# Altium schematic sheet Algorithm.SchDoc
size 420 x 297 mm
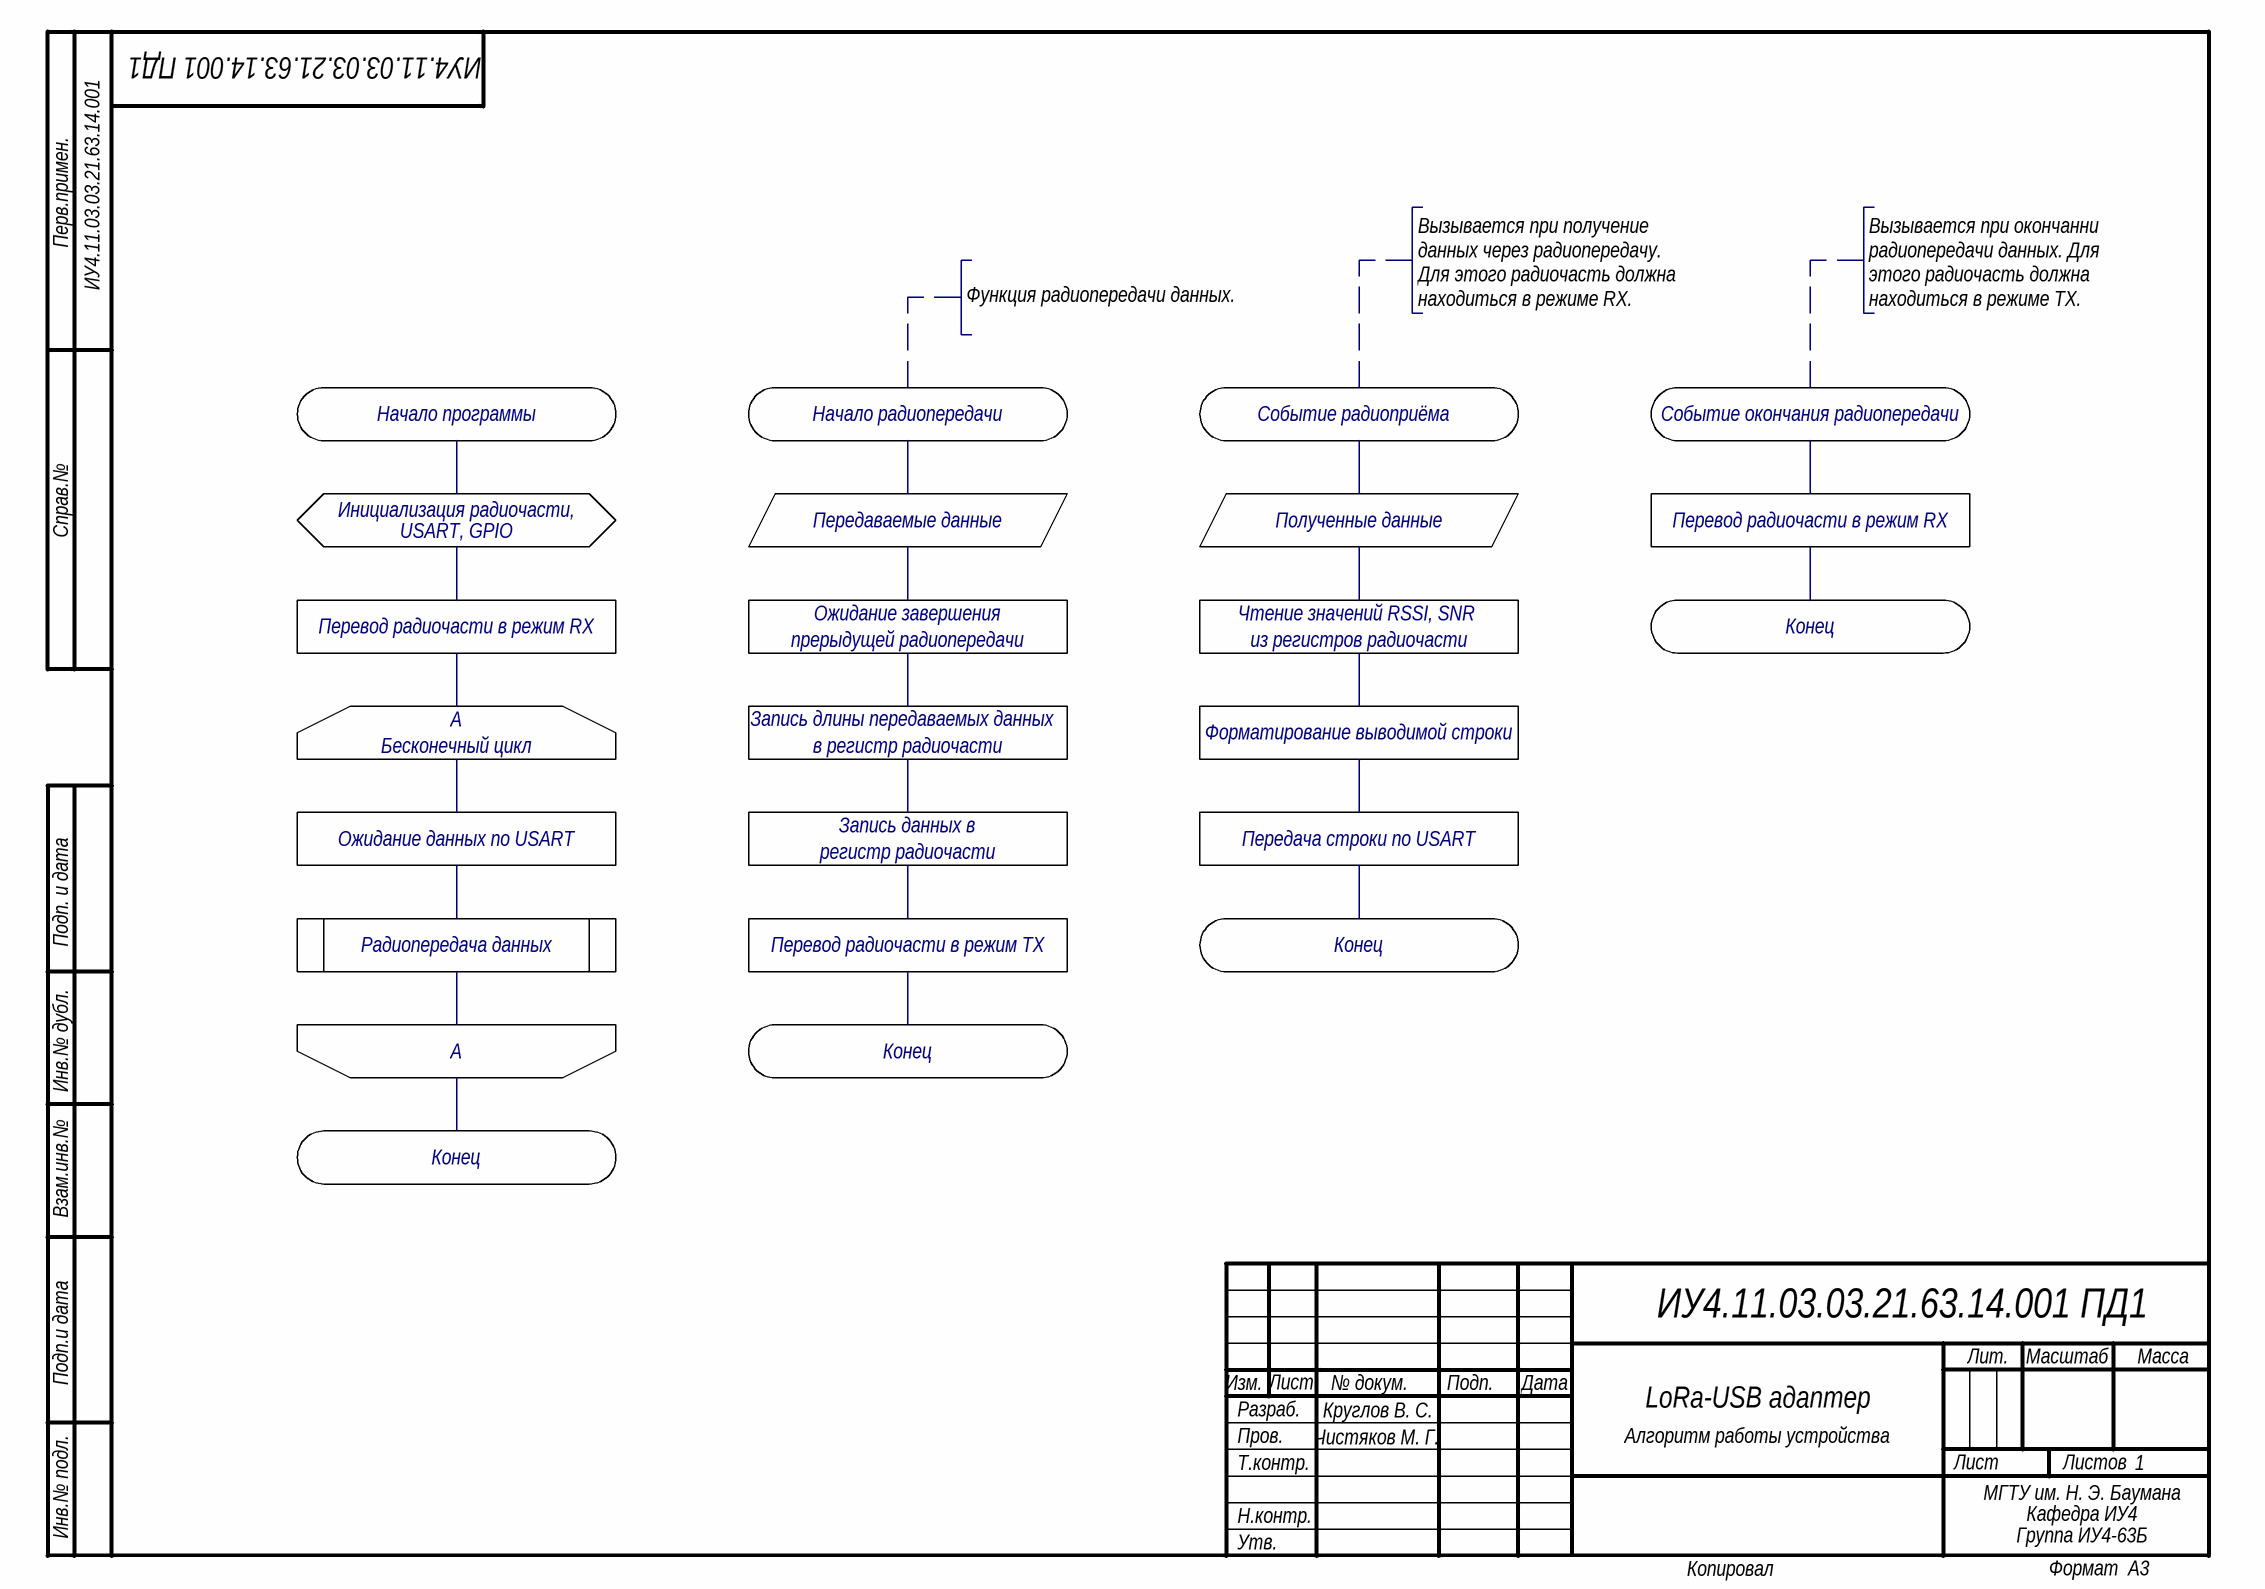
[diagram p0: Algorithm.SchDoc]

## Parts
(Parts that share a designator on the sheet are numbered #1, #2 ... from top to bottom, then left to right.)
*#1  data  (value not drawn)
*#2  cycle_start  (value not drawn)
*?#1  start  (value not drawn)
*?#2  start  (value not drawn)
*?#3  start  (value not drawn)
*?#4  start  (value not drawn)
*?#5  init  (value not drawn)
*?#6  data  (value not drawn)
*?#7  block  (value not drawn)
*?#8  block  (value not drawn)
*?#9  block  (value not drawn)
*?#10  block  (value not drawn)
*?#11  start  (value not drawn)
*?#12  block  (value not drawn)
*?#13  block  (value not drawn)
*?#14  block  (value not drawn)
*?#15  block  (value not drawn)
*?#16  block  (value not drawn)
*?#17  func  (value not drawn)
*?#18  block  (value not drawn)
*?#19  start  (value not drawn)
*?#20  cycle_start  (value not drawn)
*?#21  start  (value not drawn)
*?#22  start  (value not drawn)

## Notes on the sheet
- ИУ4.11.03.03.21.63.14.001 ПД1
- ИУ4.11.03.03.21.63.14.001
- Функция радиопередачи данных.
- Вызывается при получение данных через радиопередачу. Для этого радиочасть должна находиться в режиме RX.
- Вызывается при окончанни радиопередачи данных. Для этого радиочасть должна находиться в режиме TX.
- Начало программы
- (near *?#2) Начало радиопередачи
- (near *?#3) Событие радиоприёма
- (near *?#4) Событие окончания радиопередачи
- (near *?#5) Инициализация радиочасти,
- USART, GPIO
- Передаваемые данные
- Полученные данные
- (near *?#7) Перевод радиочасти в режим RX
- (near *?#8) Перевод радиочасти в режим RX
- Ожидание завершения
- (near *?#9) прерыдущей радиопередачи
- (near *?#10) Чтение значений RSSI, SNR
- (near *?#10) из регистров радиочасти
- Конец
- А
- (near *?#12) Запись длины передаваемых данных
- (near *?#13) Форматирование выводимой строки
- Бесконечный цикл
- (near *?#12) в регистр радиочасти
- (near *?#14) Ожидание данных по USART
- Запись данных в
- регистр радиочасти
- (near *?#16) Передача строки по USART
- (near *?#17) Радиопередача данных
- (near *?#18) Перевод радиочасти в режим TX
- Круглов В. С.
- LoRa-USB адаптер
- Чистяков М. Г.
- Алгоритм работы устройства
- 1
- МГТУ им. Н. Э. Баумана
- Кафедра ИУ4
- Группа ИУ4-63Б
- Копировал
- Перв.примен.
- Справ.№
- Подп. и дата
- Инв.№ дубл.
- Взам.инв.№
- Подп.и дата
- Разраб.
- Изм.
- Лист
- № докум.
- Подп.
- Дата
- Лит.
- Масштаб
- Масса
- Т.контр.
- Пров.
- Листов
- Инв.№ подл.
- Утв.
- Н.контр.
- Формат  A3